# EAGLE design watter.flow.metter.2 (EAGLE 8.4.1)
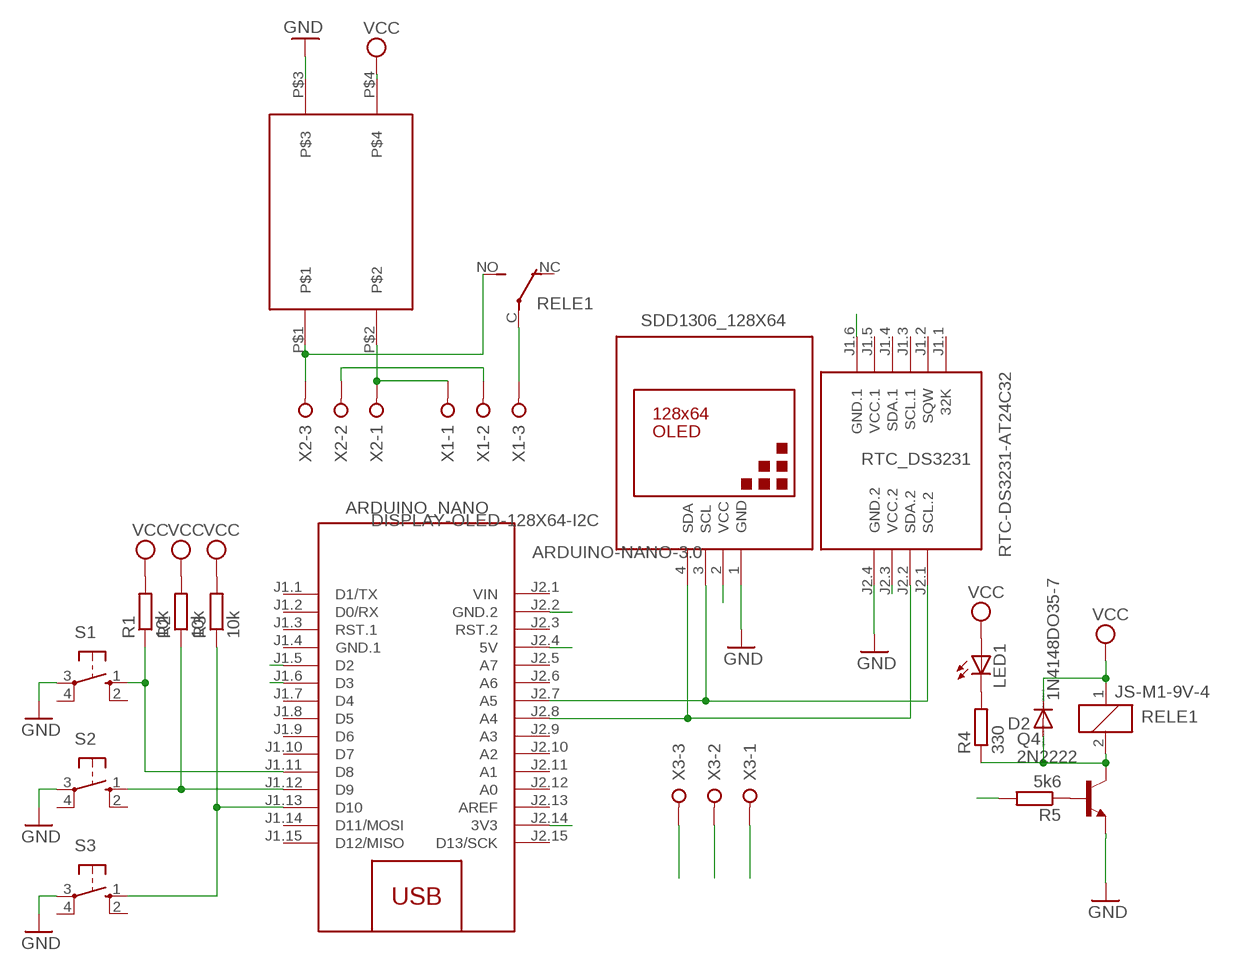
[diagram p0: schematic, sheet 1]

## Parts
ARDUINO_NANO  ARDUINO-NANO-3.0  [ARDUINO-NANO-3.0]
D2  1N4148DO35-7  [DO35-7]
LED1  LED3MM  [LED3MM]
Q4  2N2222  2N5088  [TO92]
R1  10k  R-EU_0207/10  [0207/10]
R2  10k  R-EU_0207/10  [0207/10]
R3  10k  R-EU_0207/10  [0207/10]
R4  330  R-EU_0207/10  [0207/10]
R5  5k6  R-EU_0207/10  [0207/10]
RELE1  JS-M1-9V-4  [JS-M]
RTC_DS3231  RTC-DS3231-AT24C32  [RTC-DS3231-AT24C32]
S1  10-XX  [B3F-10XX]
S2  10-XX  [B3F-10XX]
S3  10-XX  [B3F-10XX]
SDD1306_128X64  DISPLAY-OLED-128X64-I2C  [DISPLAY-OLED-128X64-I2C]
U$6  HLK-PM01  [HLK-PM01]
X1  W237-3E  [W237-3E]
X2  W237-3E  [W237-3E]
X3  W237-3E  [W237-3E]

## Nets
3.3V: ARDUINO_NANO.J2.14(3V3) RTC_DS3231.J2.3(VCC.2) SDD1306_128X64.2(VCC)
D2: ARDUINO_NANO.J1.5(D2) X3.2
D3: ARDUINO_NANO.J1.6(D3) R5.2
GND: ARDUINO_NANO.J2.2(GND.2) Q4.3(E) RTC_DS3231.J2.4(GND.2) S1.3(P) S2.3(P) S3.3(P) SDD1306_128X64.1(GND) U$6.P$3 X3.1
N$1: RELE1.C(2:P) X1.3
N$2: ARDUINO_NANO.J1.11(D8) R1.1 S1.1(S)
N$3: U$6.P$2 X1.1 X2.1
N$4: RELE1.NO(2:S) U$6.P$1 X2.3
N$5: ARDUINO_NANO.J1.12(D9) R2.1 S2.1(S)
N$6: ARDUINO_NANO.J1.13(D10) R3.1 S3.1(S)
N$7: Q4.2(B) R5.1
N$8: LED1.K(C) R4.2
N$9: RTC_DS3231.J1.6(GND.1)
N$10: X1.2 X2.2
N$41: D2.A Q4.1(C) R4.1 RELE1.2
SCL: ARDUINO_NANO.J2.7(A5) RTC_DS3231.J2.1(SCL.2) SDD1306_128X64.3(SCL)
SDA: ARDUINO_NANO.J2.8(A4) RTC_DS3231.J2.2(SDA.2) SDD1306_128X64.4(SDA)
VCC: ARDUINO_NANO.J2.4(5V) D2.C LED1.A R1.2 R2.2 R3.2 RELE1.1 U$6.P$4 X3.3
Unconnected: ARDUINO_NANO.J1.1(D1/TX) ARDUINO_NANO.J1.2(D0/RX) ARDUINO_NANO.J1.3(RST.1) ARDUINO_NANO.J1.7(D4) ARDUINO_NANO.J1.8(D5) ARDUINO_NANO.J1.9(D6) ARDUINO_NANO.J1.10(D7) ARDUINO_NANO.J1.14(D11/MOSI) ARDUINO_NANO.J1.15(D12/MISO) ARDUINO_NANO.J2.3(RST.2) ARDUINO_NANO.J2.5(A7) ARDUINO_NANO.J2.6(A6) ARDUINO_NANO.J2.9(A3) ARDUINO_NANO.J2.10(A2) ARDUINO_NANO.J2.11(A1) ARDUINO_NANO.J2.12(A0) ARDUINO_NANO.J2.13(AREF) ARDUINO_NANO.J2.15(D13/SCK) RELE1.NC(2:O) RTC_DS3231.J1.1(32K) RTC_DS3231.J1.2(SQW) RTC_DS3231.J1.3(SCL.1) RTC_DS3231.J1.4(SDA.1) S1.2(S1) S1.4(P1) S2.2(S1) S2.4(P1) S3.2(S1) S3.4(P1)

## Power pins joined to a net without a drawn wire
GND.1: ARDUINO_NANO.J1.4(GND.1)
VCC.1: RTC_DS3231.J1.5(VCC.1)
VIN: ARDUINO_NANO.J2.1(VIN)

## Library data of the parts
ARDUINO_NANO = diy-modules:ARDUINO-NANO-3.0: Arduino Nano 3.0 and compatible devices More details available here: https://www.arduino.cc/en/Main/ArduinoBoardNano Click here to find device on ebay.com <http://www.ebay.com/sch/arduino+nano>
D2 = diode:1N4148: DIODE high speed (Philips)
LED1 = led:LED: LED OSRAM: - CHIPLED LG R971, LG N971, LY N971, LG Q971, LY Q971, LO R971, LY R971 LH N974, LH R974 LS Q976, LO Q976, LY Q976 LO Q996 - Hyper CHIPLED LW Q18S LB Q993, LB Q99A, LB R99A - SideLED LS A670, LO A670, LY A670, LG A670, LP A670 LB A673, LV A673, LT A673, LW A673 LH A674 LY A675 LS A676, LA A676, LO A676, LY A676, LW A676 LS A679, LY A679, LG A679 - Hyper Micro SIDELED® LS Y876, LA Y876, LO Y876, LY Y876 LT Y87S - SmartLED LW L88C, LW L88S LB L89C, LB L89S, LG L890 LS L89K, LO L89K, LY L89K LS L896, LA L896, LO L896, LY L896 - TOPLED LS T670, LO T670, LY T670, LG T670, LP T670 LSG T670, LSP T670, LSY T670, LOP T670, LYG T670 LG T671, LOG T671, LSG T671 LB T673, LV T673, LT T673, LW T673 LH T674 LS T676, LA T676, LO T676, LY T676, LB T676, LH T676, LSB T676, LW T676 LB T67C, LV T67C, LT T67C, LS T67K, LO T67K, LY T67K, LW E67C LS E67B, LA E67B, LO E67B, LY E67B, LB E67C, LV E67C, LT E67C LW T67C LS T679, LY T679, LG T679 LS T770, LO T770, LY T770, LG T770, LP T770 LB T773, LV T773, LT T773, LW T773 LH T774 LS E675, LA E675, LY E675, LS T675 LS T776, LA T776, LO T776, LY T776, LB T776 LHGB T686 LT T68C, LB T68C - Hyper Mini TOPLED® LB M676 - Mini TOPLED Santana® LG M470 LS M47K, LO M47K, LY M47K Source: http://www.osram.convergy.de LUXEON: - LUMILED® LXK2-PW12-R00, LXK2-PW12-S00, LXK2-PW14-U00, LXK2-PW14-V00 LXK2-PM12-R00, LXK2-PM12-S00, LXK2-PM14-U00 LXK2-PE12-Q00, LXK2-PE12-R00, LXK2-PE12-S00, LXK2-PE14-T00, LXK2-PE14-U00 LXK2-PB12-K00, LXK2-PB12-L00, LXK2-PB12-M00, LXK2-PB14-N00, LXK2-PB14-P00, LXK2-PB14-Q00 LXK2-PR12-L00, LXK2-PR12-M00, LXK2-PR14-Q00, LXK2-PR14-R00 LXK2-PD12-Q00, LXK2-PD12-R00, LXK2-PD12-S00 LXK2-PH12-R00, LXK2-PH12-S00 LXK2-PL12-P00, LXK2-PL12-Q00, LXK2-PL12-R00 Source: www.luxeon.com KINGBRIGHT: KA-3528ASYC Source: www.kingbright.com
Q4 = transistor-npn:2N5088: NPN Transistor
R1-R5 = rcl:R-EU_: RESISTOR, European symbol
RELE1 = relay:JS-M1*: Automotive Ultra-Miniature Power Relay NAiS Source: http://www.mew-europe.com/.. en_ds_61211_0000.pdf; OC_FARNELL: unknown; OC_NEWARK: unknown
RTC_DS3231 = diy-modules:RTC-DS3231-AT24C32: RTC Module with Battery and EEPROM based on DS3231 and AT24C32 chips Tutorial can be found here: https://edwardmallon.wordpress.com/2014/05/21/using-a-cheap-3-ds3231-rtc-at24c32-eeprom-from-ebay/ Click here to find device on ebay.com <http://www.ebay.com/sch/DS3231+AT24C32+module>
S1-S3 = switch-omron:10-XX: OMRON SWITCH; MPN: B3F-1000; OC_FARNELL: 176432; OC_NEWARK: 36M3542
SDD1306_128X64 = diy-modules:DISPLAY-OLED-128X64-I2C: 128x64 Dot Matrix OLED Module based on SSD1306 chip Variant with I2C interface More details available here: http://www.instructables.com/id/Monochrome-096-i2c-OLED-display-with-arduino-SSD13/ SSD1306 datasheet: https://cdn-shop.adafruit.com/datasheets/SSD1306.pdf Click here to find device on ebay.com <http://www.ebay.com/sch/oled+display+128x64+iic> Note: There are two variants: I2C and SPI. Search for the proper version.
U$6 = diy-modules:HLK-PM01; HLK-PM01: HLK-PM01
X1-X3 = con-wago-508:W237-3E: WAGO SREW CLAMP; OC_FARNELL: unknown; OC_NEWARK: unknown

## Net classes
0 default: width 0.406 mm, drill 0.406 mm, clearance 0.406 mm
3 power usb: width 0.508 mm, drill 0.406 mm, clearance 0.203 mm

## Board
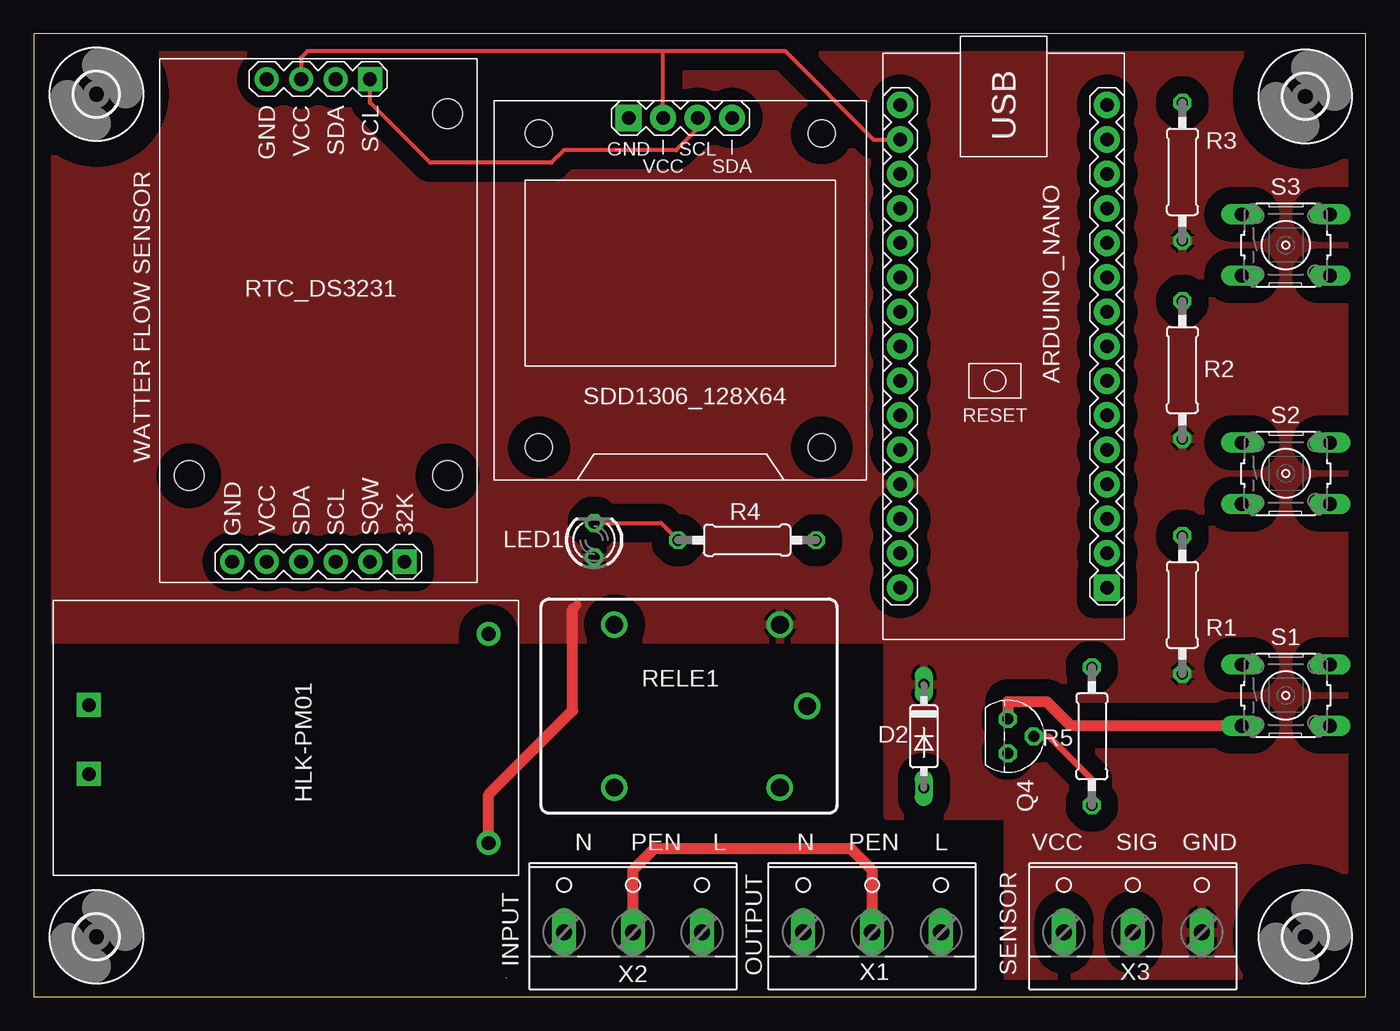
[diagram p1: board, top side]
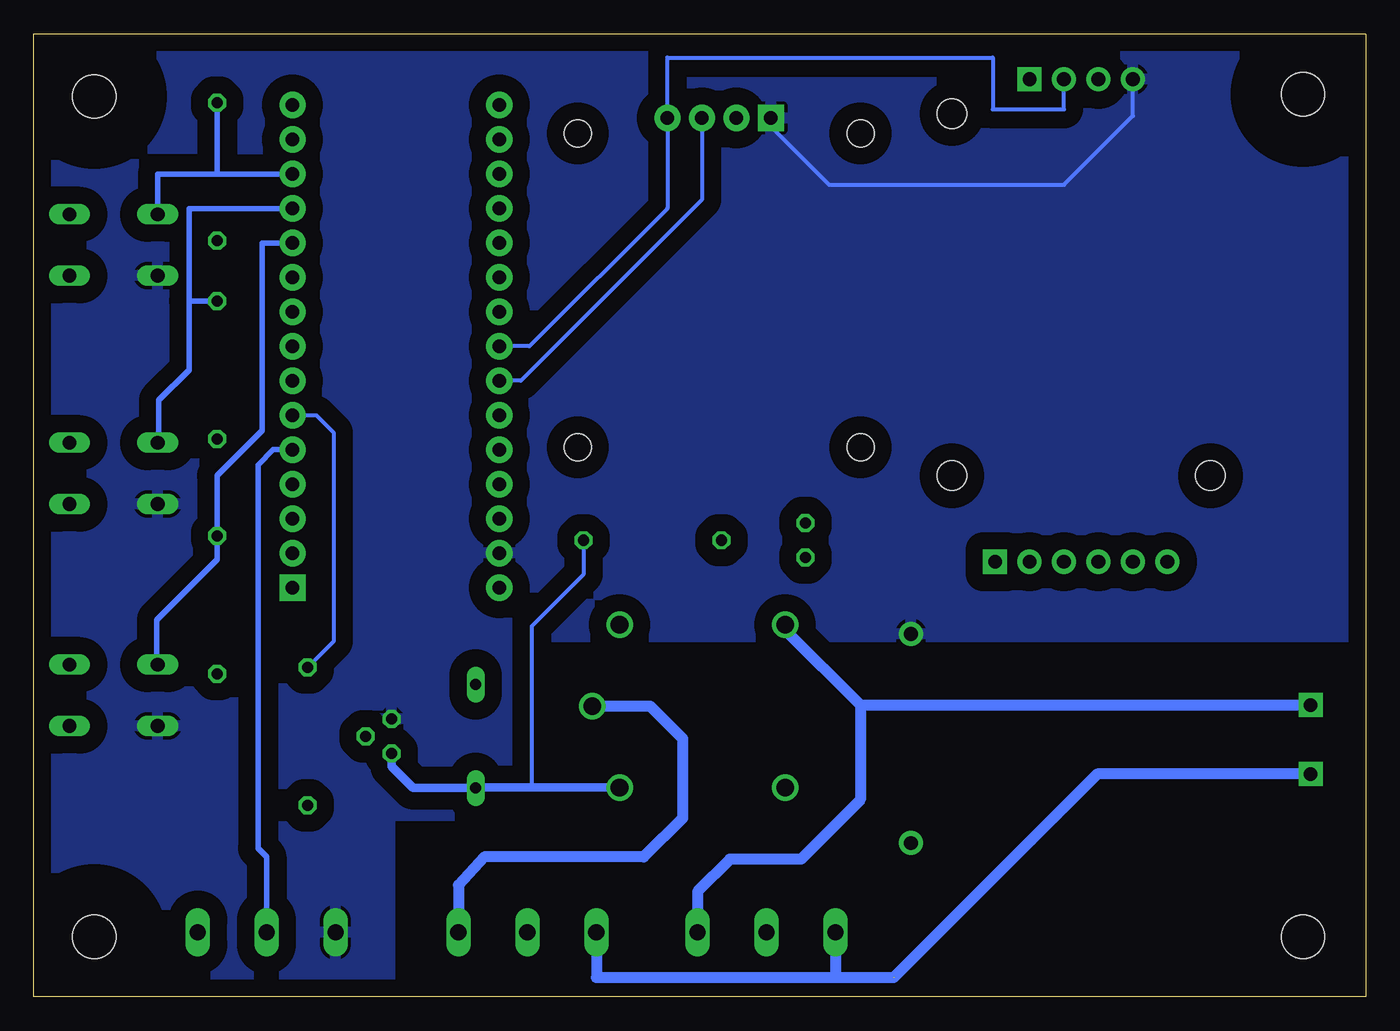
[diagram p2: board, bottom side, seen from below]

Size 98.11 x 70.96 mm. Coordinates in mm from the lower left corner, seen from the top.
Outline: 0,70.95 0,0 98.11,0 98.11,70.96 0,70.96
Copper layers (1*16): Top 0.035mm / dielectric 1.5mm / Bottom 0.035mm
Design rules "default": minimum track width 6mil, minimum drill 0.35mm, track to track 6mil, track to pad 6mil, pad to pad 6mil, via to via 6mil, smd to smd 6mil, copper to edge 40mil, drill to drill 6mil, minimum pad ring 10mil, minimum via ring 8mil, stop-mask expansion 4mil, vias tented up to drill 0mil, thermal gap 10mil

### Footprints (pad centres in the part's own frame; a part is rotated, then mirrored left to right if it is on the bottom)
ARDUINO-NANO-3.0 = drill 1 pad 1.93 square: J1.1 17.78,7.62 | drill 1 pad 1.93: J1.2 15.24,7.62; J1.3 12.7,7.62; J1.4 10.16,7.62; J1.5 7.62,7.62; J1.6 5.08,7.62; J1.7 2.54,7.62; J1.8 0,7.62; J1.9 -2.54,7.62; J1.10 -5.08,7.62; J1.11 -7.62,7.62; J1.12 -10.16,7.62; J1.13 -12.7,7.62; J1.14 -15.24,7.62; J1.15 -17.78,7.62; J2.1 17.78,-7.62; J2.2 15.24,-7.62; J2.3 12.7,-7.62; J2.4 10.16,-7.62; J2.5 7.62,-7.62; J2.6 5.08,-7.62; J2.7 2.54,-7.62; J2.8 0,-7.62; J2.9 -2.54,-7.62; J2.10 -5.08,-7.62; J2.11 -7.62,-7.62; J2.12 -10.16,-7.62; J2.13 -12.7,-7.62; J2.14 -15.24,-7.62; J2.15 -17.78,-7.62
DO35-7 = drill 0.813 long: A 3.81,0; C -3.81,0
LED3MM = drill 0.813 octagon: A -1.27,0; K 1.27,0
TO92 = drill 0.813 octagon: 1 1.27,0; 2 0,1.905; 3 -1.27,0
0207/10 = drill 0.813 octagon: 1 -5.08,0; 2 5.08,0
JS-M = drill 1.3: 1 6.7,6; 2 6.7,-6; C 8.7,0; NC -5.5,-6; NO -5.5,6
RTC-DS3231-AT24C32 = drill 1 pad 1.778 square: J1.1 -17.78,-6.35; J2.1 17.78,-3.81 | drill 1 pad 1.778: J1.2 -17.78,-3.81; J1.3 -17.78,-1.27; J1.4 -17.78,1.27; J1.5 -17.78,3.81; J1.6 -17.78,6.35; J2.2 17.78,-1.27; J2.3 17.78,1.27; J2.4 17.78,3.81 | hole 2.2: -11.43,-9.525; -11.43,9.525; 15.24,-9.525
B3F-10XX = drill 1.016 long: 1 -3.251,2.261; 2 3.251,2.261; 3 -3.251,-2.261; 4 3.251,-2.261
DISPLAY-OLED-128X64-I2C = drill 1 pad 1.93 square: 1 -3.81,12.7 | drill 1 pad 1.93: 2 -1.27,12.7; 3 1.27,12.7; 4 3.81,12.7 | hole 2: -10.414,11.557; 10.414,11.557; 10.414,-11.557; -10.414,-11.557
3,2 = hole 3.2: 0,0
HLK-PM01 = drill 1 pad 1.778 square: P$1 7.699,2.619; P$2 12.779,2.619 | drill 1 pad 1.778: P$3 2.461,32.068; P$4 17.859,32.068
W237-3E = drill 1.194 long: 1 -5.08,-0.635; 2 0,-0.635; 3 5.08,-0.635

### Placement (x,y rotation side)
ARDUINO_NANO  71.44,47.94 270 top
D2  65.56,19.21 270 top
LED1  41.27,33.66 90 top
Q4  71.75,19.21 270 top
R1  84.61,28.89 270 top
R2  84.61,46.2 270 top
R3  84.61,60.8 270 top
R4  52.55,33.66 180 top
R5  77.95,19.21 90 top
RELE1  48.26,21.43 0 top
RTC_DS3231  20.95,49.85 90 top
S1  92.23,22.22 0 top
S2  92.23,38.58 0 top
S3  92.23,55.4 0 top
SDD1306_128X64  47.62,52.07 0 top
U$3  [3,2]  4.6,66.52 0 top
U$4  [3,2]  4.6,4.45 0 top
U$6  1.43,29.21 270 top
U$7  [3,2]  93.66,66.36 0 top
U$8  [3,2]  93.66,4.45 0 top
X1  61.75,5.4 0 top
X2  44.13,5.4 0 top
X3  80.96,5.4 0 top

### Tracks (layer width: path | path; a pad name or v marks a point on that pad's centre or on a via)
3.3V
  Top 0.305: ARDUINO_NANO.J2.14 61.86,63.18 55.35,69.69 46.43,69.69 | SDD1306_128X64.2 46.35,69.62 46.43,69.69 | RTC_DS3231.J2.3 19.68,69.21 20.16,69.69 46.43,69.69
D2
  Bottom 0.406: ARDUINO_NANO.J1.5 80.49,40.32 81.6,39.21 81.6,10.95 80.96,10.32 X3.2
D3
  Bottom 0.305: ARDUINO_NANO.J1.6 77.31,42.86 76.04,41.59 76.04,26.19 R5.2
  Bottom 0.406: R5.2 77.95,24.45
GND
  Top 0.813: S1.3 88.94,20 76.36,20 74.61,21.75 71.75,21.75 Q4.3
  Bottom 0.305: SDD1306_128X64.1 43.81,64.13 39.53,59.85 22.22,59.85 17.14,64.93 RTC_DS3231.J2.4
  Bottom 0.813: 88.98,36.35 S2.3
  pour Bottom (isolate 1.27): 0.16,71.28 0.16,26.51 33.65,26.51 61.75,26.51 61.75,13.33 71.91,13.33 71.91,0.16 98.27,0.16 98.27,71.28
N$1
  Bottom 0.813: X1.3 66.83,8.25 64.93,10.32 53.18,10.32 50.32,13.18 50.32,19.05 52.7,21.43 RELE1.C
N$2
  Bottom 0.406: ARDUINO_NANO.J1.11 81.28,55.56 81.28,41.75 84.61,38.42 R1.1 84.61,32.23 89.06,27.78 89.06,24.56 S1.1
N$3  (1 unrouted)
  Bottom 0.813: 39.06,1.43 56.67,1.43 X1.1 | 34.77,1.43 39.06,1.43 | X2.1 39.05,1.43 39.06,1.43 | 34.73,1.46 19.76,16.43 U$6.P$2
N$4
  Bottom 0.813: X2.3 49.21,7.78 46.83,10.16 41.59,10.16 37.23,14.53 37.23,21.51 | 37.23,21.51 U$6.P$1 | RELE1.NO 42.76,27.04 37.23,21.51
N$5
  Bottom 0.406: ARDUINO_NANO.J1.12 86.68,58.1 86.68,51.28 | R2.1 86.68,51.28 | S2.1 88.9,40.92 88.9,43.97 86.68,46.2 86.68,51.28
N$6
  Bottom 0.406: 84.6,60.64 ARDUINO_NANO.J1.13 | 84.6,60.64 88.98,60.64 S3.1 | R3.1 84.6,65.88 84.6,60.64
N$7
  Top 0.406: Q4.2 74.77,19.21 77.95,16.03 R5.1
N$8
  Top 0.305: LED1.K 46.2,34.92 R4.2
N$10
  Top 0.813: X2.2 44.13,9.37 45.72,10.95 60.17,10.95 61.75,9.37 X1.2
N$41
  Bottom 0.305: R4.1 57.63,31.11 61.44,27.3 61.44,15.45 61.46,15.43
  Bottom 0.61: RELE1.2 61.46,15.43 65.53,15.43 D2.A 70.17,15.4 71.75,16.99 Q4.1
SCL
  Top 0.305: SDD1306_128X64.3 48.89,63.98 47.31,62.39 39.04,62.39 38.11,61.46 29.19,61.46 24.76,65.88 RTC_DS3231.J2.1
  Bottom 0.305: SDD1306_128X64.3 48.89,58.74 62.23,45.4 ARDUINO_NANO.J2.7
SDA
  Bottom 0.305: RTC_DS3231.J2.2 22.22,65.4 27.46,65.4 27.46,69.21 51.43,69.21 SDD1306_128X64.4 51.43,58.1 61.59,47.94 ARDUINO_NANO.J2.8
VCC
  Top 0.61: 39.69,28.57 40,28.89
  Top 0.813: U$6.P$4 33.5,14.92 39.69,21.11 39.69,28.57
  pour Top (isolate 1.27): 0.16,71.12 0.16,26.35 62.87,26.35 62.87,13.33 71.75,13.33 71.75,0.16 98.11,0.16 98.11,71.12

### Text on the board
tNames: WATTER FLOW SENSOR | N | PEN | L | N | PEN | L | VCC | SIG | GND | INPUT | OUTPUT | SENSOR